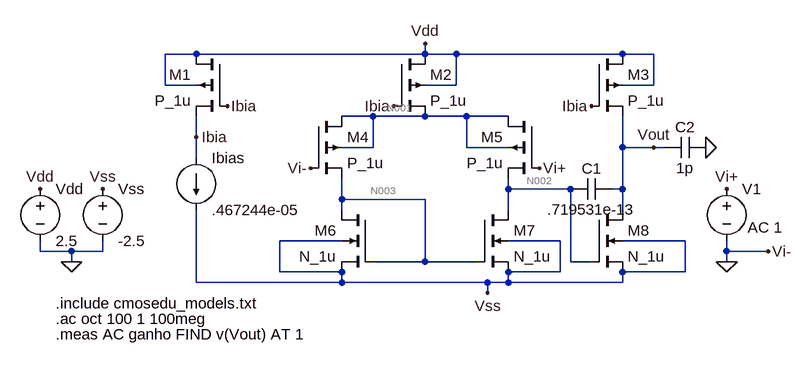
[diagram p0: schematic Parte 2 com valores de melhor ganho.asc]
Parte 2 com valores de melhor ganho.asc, the LTspice schematic file:
Version 4
SHEET 1 1120 680
WIRE 192 32 144 32
WIRE 544 32 544 16
WIRE 544 32 192 32
WIRE 592 32 544 32
WIRE 848 32 592 32
WIRE 896 32 848 32
WIRE 144 80 144 32
WIRE 192 80 144 80
WIRE 592 80 592 32
WIRE 592 80 544 80
WIRE 896 80 896 32
WIRE 896 80 848 80
WIRE 464 128 416 128
WIRE 544 128 464 128
WIRE 608 128 544 128
WIRE 672 128 608 128
WIRE 192 160 192 128
WIRE 464 176 464 128
WIRE 464 176 416 176
WIRE 608 176 608 128
WIRE 672 176 608 176
WIRE 848 176 848 128
WIRE 896 176 848 176
WIRE 912 176 896 176
WIRE 192 192 192 160
WIRE 672 240 672 224
WIRE 768 240 672 240
WIRE 848 240 848 176
WIRE 848 240 832 240
WIRE 416 256 416 224
WIRE 544 256 416 256
WIRE 416 272 416 256
WIRE 672 272 672 240
WIRE 848 272 848 240
WIRE 416 320 320 320
WIRE 752 320 672 320
WIRE 944 320 848 320
WIRE -48 336 -48 320
WIRE 0 336 -48 336
WIRE 48 336 48 320
WIRE 48 336 0 336
WIRE 1008 336 1008 320
WIRE 1072 336 1008 336
WIRE 0 352 0 336
WIRE 544 352 544 256
WIRE 544 352 464 352
WIRE 624 352 544 352
WIRE 768 352 768 240
WIRE 800 352 768 352
WIRE 1008 352 1008 336
WIRE 320 368 320 320
WIRE 416 368 320 368
WIRE 752 368 752 320
WIRE 752 368 672 368
WIRE 944 368 944 320
WIRE 944 368 848 368
WIRE 192 384 192 272
WIRE 416 384 416 368
WIRE 416 384 192 384
WIRE 640 384 416 384
WIRE 672 384 672 368
WIRE 672 384 640 384
WIRE 848 384 848 368
WIRE 848 384 672 384
WIRE 640 400 640 384
FLAG 544 16 Vdd
FLAG 640 400 Vss
FLAG 192 160 Ibia
FLAG 240 112 Ibia
FLAG 496 112 Ibia
FLAG 800 112 Ibia
FLAG 368 208 Vi-
FLAG 720 208 Vi+
FLAG -48 240 Vdd
FLAG 48 240 Vss
FLAG 0 352 0
FLAG 1008 352 0
FLAG 1072 336 Vi-
FLAG 1008 240 Vi+
FLAG 896 176 Vout
FLAG 976 176 0
SYMBOL pmos4 240 32 M0
SYMATTR InstName M1
SYMATTR Value P_1u
SYMATTR Value2 l=20.479769u w=3.312637
SYMBOL pmos4 496 32 R0
SYMATTR InstName M2
SYMATTR Value P_1u
SYMATTR Value2 l=20.479769u w=2.802842
SYMBOL pmos4 800 32 R0
SYMATTR InstName M3
SYMATTR Value P_1u
SYMATTR Value2 l=20.479769u w=10.194599
SYMBOL pmos4 368 128 R0
SYMATTR InstName M4
SYMATTR Value P_1u
SYMATTR Value2 l=36.630219 w=46.125000
SYMBOL pmos4 720 128 M0
SYMATTR InstName M5
SYMATTR Value P_1u
SYMATTR Value2 l=36.630219 w=46.125000
SYMBOL nmos4 464 272 M0
SYMATTR InstName M6
SYMATTR Value N_1u
SYMATTR Value2 l=50.000000u w=23.973370
SYMBOL nmos4 624 272 R0
SYMATTR InstName M7
SYMATTR Value N_1u
SYMATTR Value2 l=50.000000u w=23.973370
SYMBOL nmos4 800 272 R0
SYMATTR InstName M8
SYMATTR Value N_1u
SYMATTR Value2 l=15.538221u w=50.000000
SYMBOL current 192 192 R0
WINDOW 123 0 0 Left 2
WINDOW 39 0 0 Left 2
SYMATTR InstName Ibias
SYMATTR Value .467244e-05
SYMBOL cap 832 224 R90
WINDOW 0 0 32 VBottom 2
WINDOW 3 32 32 VTop 2
SYMATTR InstName C1
SYMATTR Value .719531e-13
SYMBOL voltage -48 224 R0
WINDOW 123 0 0 Left 2
WINDOW 39 0 0 Left 2
SYMATTR InstName Vdd
SYMATTR Value 2.5
SYMBOL voltage 48 224 R0
WINDOW 123 0 0 Left 2
WINDOW 39 0 0 Left 2
SYMATTR InstName Vss
SYMATTR Value -2.5
SYMBOL voltage 1008 224 R0
WINDOW 123 32 75 Left 2
WINDOW 39 0 0 Left 2
SYMATTR Value2 AC 1
SYMATTR InstName V1
SYMATTR Value ""
SYMBOL cap 976 160 R90
WINDOW 0 0 32 VBottom 2
WINDOW 3 32 32 VTop 2
SYMATTR InstName C2
SYMATTR Value 1p
TEXT -24 416 Left 2 !.include cmosedu_models.txt
TEXT -24 440 Left 2 !.ac oct 100 1 100meg
TEXT -24 464 Left 2 !.meas AC ganho FIND v(Vout) AT 1

The netlist it stands for:
* Parte 2 com valores de melhor ganho.asc
M1 Vdd Ibia Ibia Vdd P_1u l=20.479769u w=3.312637
M2 Vdd Ibia N001 Vdd P_1u l=20.479769u w=2.802842
M3 Vdd Ibia Vout Vdd P_1u l=20.479769u w=10.194599
M4 N001 0 N003 N001 P_1u l=36.630219 w=46.125000
M5 N001 Vi+ N002 N001 P_1u l=36.630219 w=46.125000
M6 N003 N003 Vss Vss N_1u l=50.000000u w=23.973370
M7 N002 N003 Vss Vss N_1u l=50.000000u w=23.973370
M8 Vout N002 Vss Vss N_1u l=15.538221u w=50.000000
Ibias Ibia Vss .467244e-05
C1 Vout N002 .719531e-13
Vdd Vdd 0 2.5
Vss Vss 0 -2.5
V1 Vi+ 0 AC 1
C2 0 Vout 1p
.model NMOS NMOS
.model PMOS PMOS
.lib standard.mos
.include cmosedu_models.txt
.ac oct 100 1 100meg
.meas AC ganho FIND v(Vout) AT 1
.backanno
.end

* Results of the author's LTspice run, read from the files saved beside the schematic
* Operating Point, zero values left out:
*   V(vdd) = 2.5 V
*   V(ibia) = 1.994 V
*   V(n001) = 1.209 V
*   V(vout) = 2.46 V
*   V(n003) = -2.256 V
*   V(n002) = -2.256 V
*   V(vss) = -2.5 V
*   Id(M8) = 13.75 µA
*   Ib(M8) = -4.97 pA
*   Is(M8) = -13.75 µA
*   Id(M7) = 1.977 µA
*   Is(M7) = -1.977 µA
*   Id(M6) = 1.977 µA
*   Is(M6) = -1.977 µA
*   Id(M5) = 1.977 µA
*   Ib(M5) = 3.475 pA
*   Is(M5) = -1.977 µA
*   Id(M4) = 1.977 µA
*   Ib(M4) = 3.475 pA
*   Is(M4) = -1.977 µA
*   Id(M3) = 13.74 µA
*   Is(M3) = -13.74 µA
*   Id(M2) = 3.953 µA
*   Ib(M2) = 1.301 pA
*   Is(M2) = -3.953 µA
*   Id(M1) = 4.672 µA
*   Is(M1) = -4.672 µA
*   I(Ibias) = 4.672 µA
*   I(Vss) = 22.37 µA
*   I(Vdd) = -22.37 µA
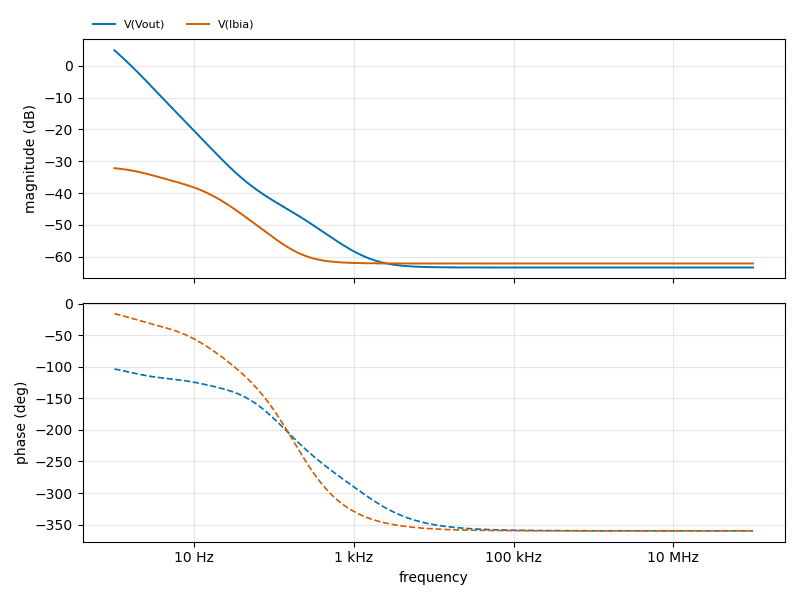
[diagram p1: AC Analysis of Parte 2 com valores de melhor ganho.asc, plotted from the saved traces]
* AC Analysis, 1 run:
*   V(Vout): 4.92 dB at 1 Hz, -63.43 dB at 100 MHz, peak 4.92 dB at 1 Hz, 3 dB below the peak at 1.354 Hz
*   V(Ibia): -32.18 dB at 1 Hz, -62.17 dB at 100 MHz, peak -32.18 dB at 1 Hz, 3 dB below the peak at 3.878 Hz
* From the log:
*   ganho: v(vout)=(4.91767dB,-103.287°) at 1